# Altium schematic sheet pca10090_sheet8_power_supply.SchDoc: Power Supply
size A3; Organization: Nordic Semiconductor; DocumentNumber: 8; SheetNumber: 8; SheetTotal: 8; CompanyName: Nordic Semiconductor; DocumentSize: A3
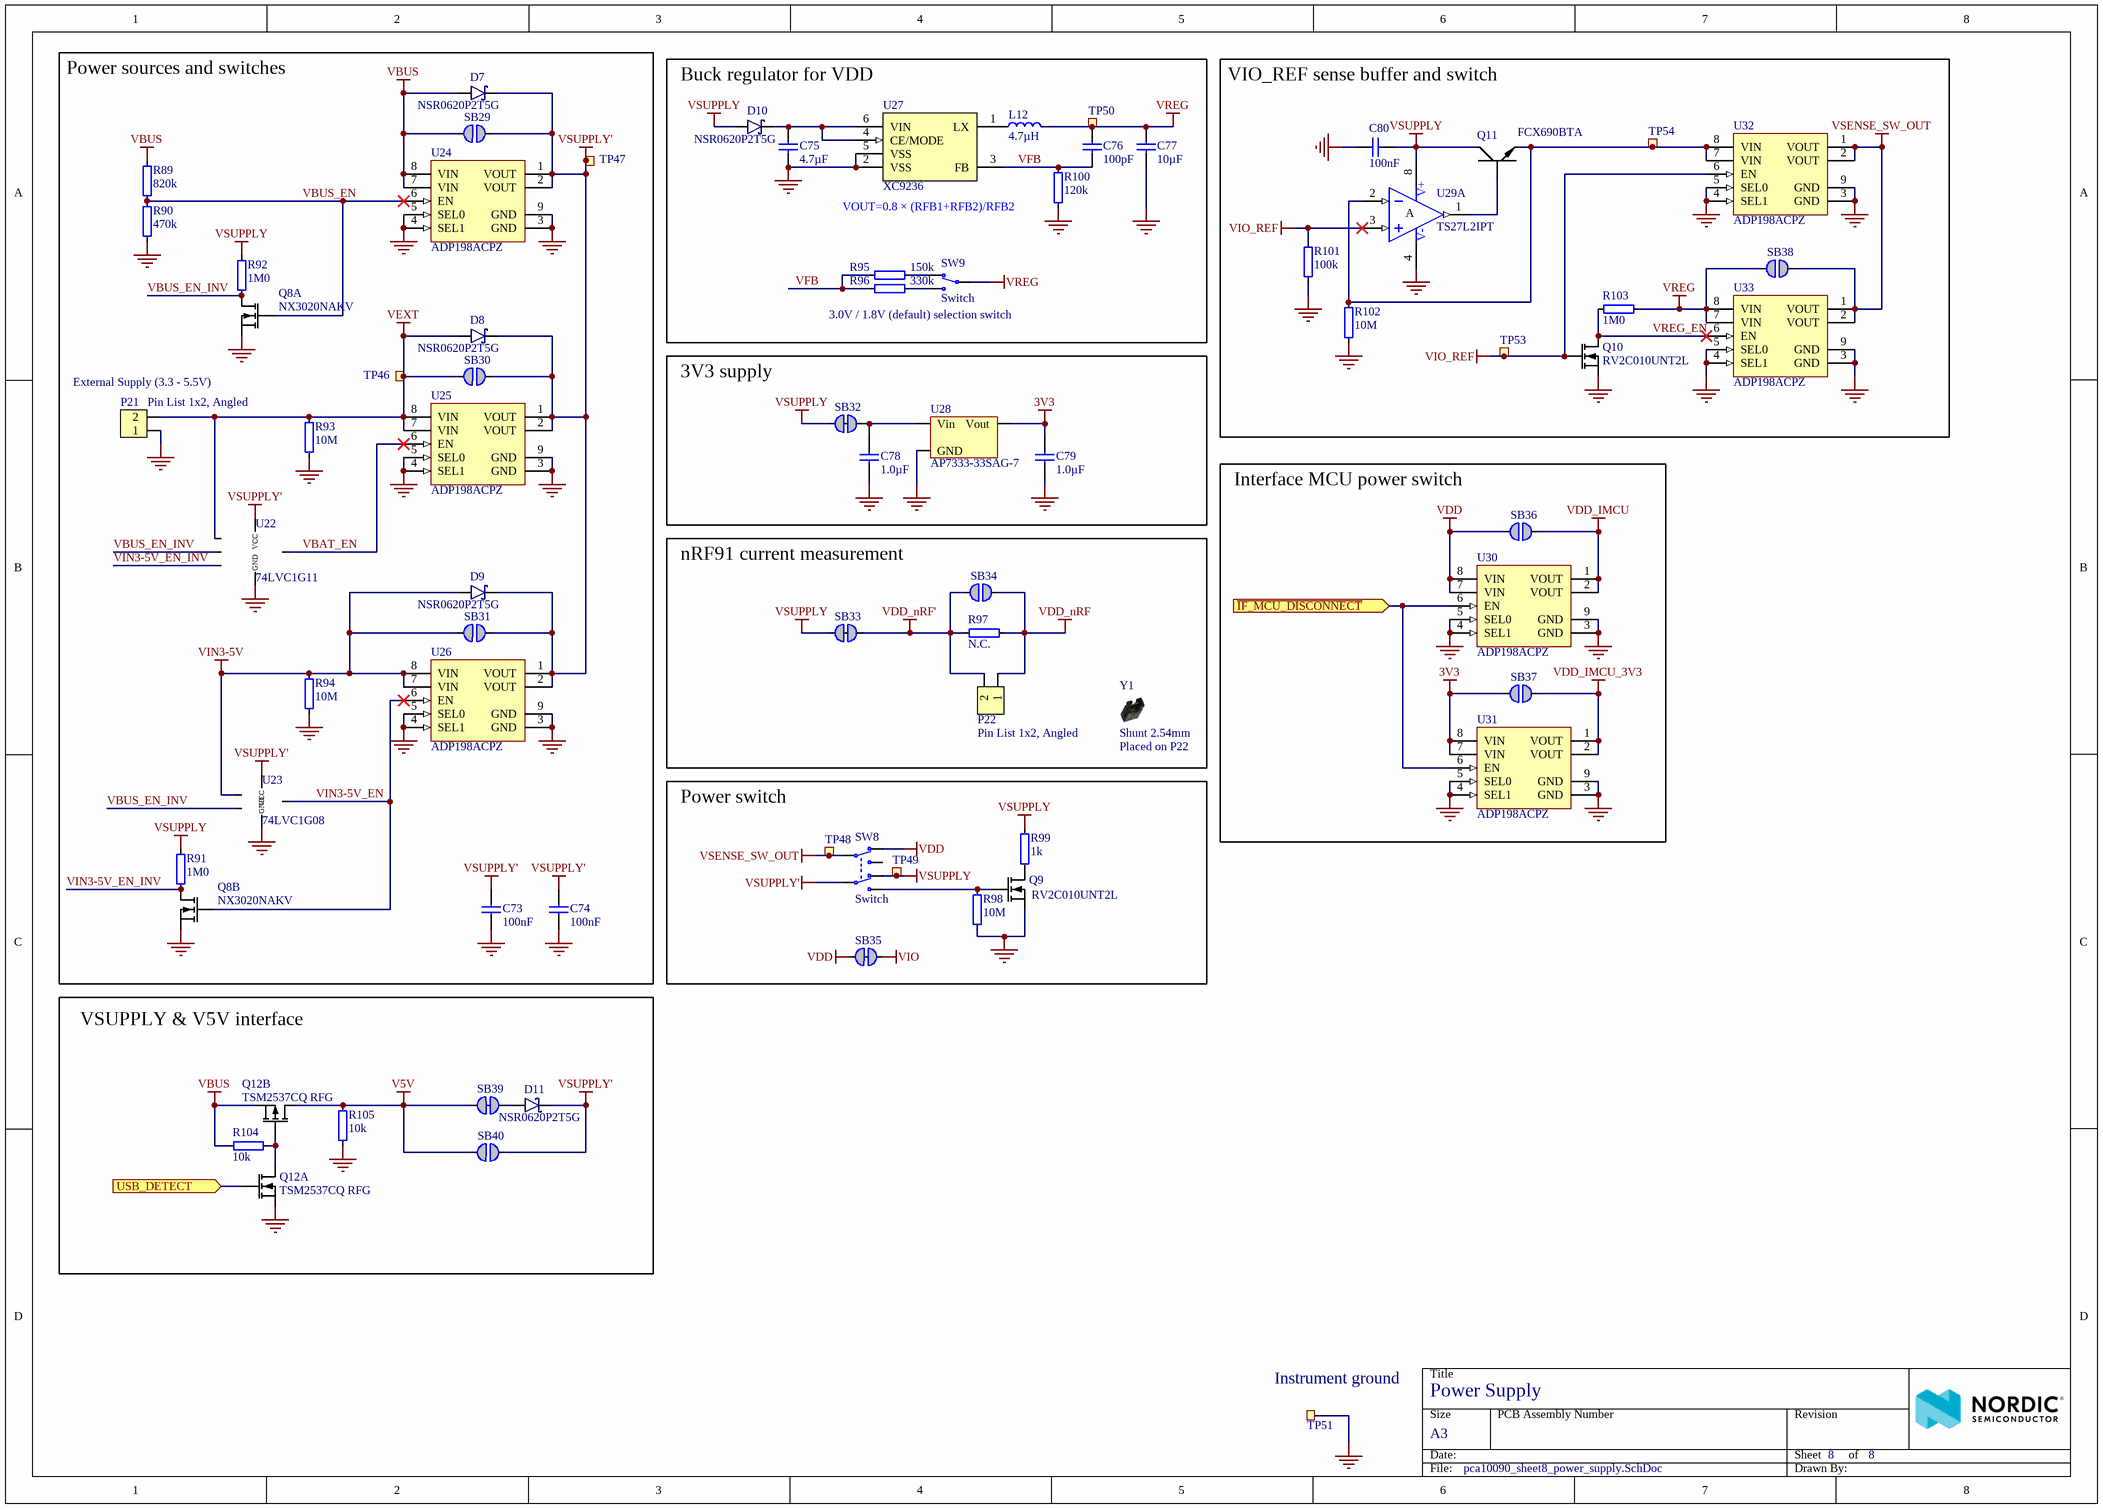
[diagram p0: pca10090_sheet8_power_supply.SchDoc]

## Parts
C73  100nF  [CAPC0603X03L_C]
C74  100nF  [CAPC0603X03L_C]
C75  4.7µF  [CAPC1005X04L]
C76  100pF  [CAPC0603X03L_C]
C77  10µF  [CAPC1608X06L]
C78  1.0µF  [CAPC0603X03L_C]
C79  1.0µF  [CAPC0603X03L_C]
C80  100nF  [CAPC0603X03L_C]
D7  NSR0620P2T5G  [SODFL100X40-2N]
D8  NSR0620P2T5G  [SODFL100X40-2N]
D9  NSR0620P2T5G  [SODFL100X40-2N]
D10  NSR0620P2T5G  [SODFL100X40-2N]
D11  NSR0620P2T5G  [SODFL100X40-2N]
L12  4.7µH  [TY-NR3015]
P21  Pin List 1x2, Angled  [LIST_ANG_1x2-SMD-2.54MM]
P22  Pin List 1x2, Angled  [LIST_ANG_1x2-SMD-2.54MM]
Q8  NX3020NAKV  [NX3020NAKV]  (parts A,B of 2)
Q9  RV2C010UNT2L  [DFN65P100X40-3L]
Q10  RV2C010UNT2L  [DFN65P100X40-3L]
Q11  FCX690BTA  [SOT89-150P409X160-3N]
Q12  TSM2537CQ RFG  [DFN65P200X200X80_HS-6N]  (parts A,B of 2)
R89  820k  [RESC0603X03L_C]
R90  470k  [RESC0603X03L_C]
R91  1M0  [RESC0603X03L_C]
R92  1M0  [RESC0603X03L_C]
R93  10M  [RESC0603X03L_C]
R94  10M  [RESC0603X03L_C]
R95  150k  [RESC0603X03L_C]
R96  330k  [RESC0603X03L_C]
R97  N.C.  [RESC1005X04L_NC]
R98  10M  [RESC0603X03L_C]
R99  1k  [RESC0603X03L_C]
R100  120k  [RESC0603X03L_C]
R101  100k  [RESC0603X03L_C]
R102  10M  [RESC0603X03L_C]
R103  1M0  [RESC0603X03L_C]
R104  10k  [RESC0603X03L_C]
R105  10k  [RESC0603X03L_C]
SB29  Solderbridge  [Solderbridge]  (value not drawn)  (no BOM)
SB30  Solderbridge  [Solderbridge]  (value not drawn)  (no BOM)
SB31  Solderbridge  [Solderbridge]  (value not drawn)  (no BOM)
SB32  Solderbridge  [Solderbridge_Shorted]  (value not drawn)  (net tie, no BOM)
SB33  Solderbridge  [Solderbridge_Shorted_Power]  (value not drawn)  (net tie, no BOM)
SB34  Solderbridge  [Solderbridge]  (value not drawn)  (no BOM)
SB35  Solderbridge  [Solderbridge_Shorted]  (value not drawn)  (net tie, no BOM)
SB36  Solderbridge  [Solderbridge]  (value not drawn)  (no BOM)
SB37  Solderbridge  [Solderbridge]  (value not drawn)  (no BOM)
SB38  Solderbridge  [Solderbridge]  (value not drawn)  (no BOM)
SB39  Solderbridge  [Solderbridge_Shorted]  (value not drawn)  (net tie, no BOM)
SB40  Solderbridge  [Solderbridge]  (value not drawn)  (no BOM)
SW8  Switch  [JS102011JAQN]
SW9  Switch  [CJS-120xA]
TP46  Ø1.5mm,SMD  [TP_SMD_D1.5mm]  (value not drawn)  (no BOM)
TP47  Ø1.5mm,SMD  [TP_SMD_D1.5mm]  (value not drawn)  (no BOM)
TP48  Ø1.5mm,SMD  [TP_SMD_D1.5mm]  (value not drawn)  (no BOM)
TP49  Ø1.5mm,SMD  [TP_SMD_D1.5mm]  (value not drawn)  (no BOM)
TP50  Ø1.5mm,SMD  [TP_SMD_D1.5mm]  (value not drawn)  (no BOM)
TP51  TP  [TESTPAD-TH]  (value not drawn)  (no BOM)
TP53  Ø1.5mm,SMD  [TP_SMD_D1.5mm]  (value not drawn)  (no BOM)
TP54  Ø1.5mm,SMD  [TP_SMD_D1.5mm]  (value not drawn)  (no BOM)
U22  74LVC1G11  [SOT65P210X100-6N]
U23  74LVC1G08  [SOT65P210X100-5N]
U24  ADP198ACPZ  [UFDFN50P200X200X60_HS-9N]
U25  ADP198ACPZ  [UFDFN50P200X200X60_HS-9N]
U26  ADP198ACPZ  [UFDFN50P200X200X60_HS-9N]
U27  XC9236  [USP-6C]
U28  AP7333-33SAG-7  [SOT-23A]
U29  TS27L2IPT  [TSOP65P640X120-8N]  (part A of 2)
U30  ADP198ACPZ  [UFDFN50P200X200X60_HS-9N]
U31  ADP198ACPZ  [UFDFN50P200X200X60_HS-9N]
U32  ADP198ACPZ  [UFDFN50P200X200X60_HS-9N]
U33  ADP198ACPZ  [UFDFN50P200X200X60_HS-9N]
Y1  Shunt 2.54mm  Assembly: Placed on P22  [Shunt_2.54mm_Horizontal]

## Blocks framed on the sheet
Power sources and switches: C73 C74 D7-D9 P21 Q8 R89-R94 SB29-SB31 TP46 TP47 U22-U26
Buck regulator for VDD: C75-C77 D10 L12 R95 R96 R100 SW9 TP50 U27
VIO_REF sense buffer and switch: C80 Q10 Q11 R101-R103 SB38 TP53 TP54 U29 U32 U33
3V3 supply: C78 C79 SB32 U28
Interface MCU power switch: SB36 SB37 U30 U31
nRF91 current measurement: P22 R97 SB33 SB34 Y1
Power switch: Q9 R98 R99 SB35 SW8 TP48 TP49
VSUPPLY & V5V interface: D11 Q12 R104 R105 SB39 SB40

## Ports
USB_DETECT (in), ~{IF_MCU_DISCONNECT} (in)

## Nets
3V3: C79.1 SB37.1 U28.2(Vout) U31.7(VIN) U31.8(VIN)
GND: C73.2 C74.1 C75.1 C77.1 C78.2 C79.2 C80.1 P21.1 Q8.1(S1) Q8.4(S2) Q9.2(S) Q10.2(S) Q12.1(S1) R90.1 R93.1 R94.1 R98.1 R100.1 R101.2 R102.1 R105.1 TP51.1 U22.2(GND) U23.3(GND) U24.3(GND) U24.4(SEL1) U24.5(SEL0) U24.9(GND) U25.3(GND) U25.4(SEL1) U25.5(SEL0) U25.9(GND) U26.3(GND) U26.4(SEL1) U26.5(SEL0) U26.9(GND) U27.2(VSS) U27.5(VSS) U27.7(VSS) U28.3(GND) U29.4(V-) U30.3(GND) U30.4(SEL1) U30.5(SEL0) U30.9(GND) U31.3(GND) U31.4(SEL1) U31.5(SEL0) U31.9(GND) U32.3(GND) U32.4(SEL1) U32.5(SEL0) U32.9(GND) U33.3(GND) U33.4(SEL1) U33.5(SEL0) U33.9(GND)
V5V: Q12.3(D2) R105.2 SB39.1 SB40.2
VBUS: D7.2(A) Q12.4(S2) R89.2 R104.1 SB29.2 U24.7(VIN) U24.8(VIN)
VDD: SB35.2 SB36.2 SW8.3(N.C-1) U30.7(VIN) U30.8(VIN)
VDD_IMCU: SB36.1 U30.1(VOUT) U30.2(VOUT)
VDD_IMCU_3V3: SB37.2 U31.1(VOUT) U31.2(VOUT)
VDD_nRF: P22.1 R97.1 SB34.1
VDD_nRF': P22.2 R97.2 SB33.2 SB34.2
VEXT: D8.2(A) P21.2 R93.2 SB30.2 TP46.1 U22.1(A) U25.7(VIN) U25.8(VIN)
VIN3-5V: D9.2(A) R94.2 SB31.2 U23.1(A) U26.7(VIN) U26.8(VIN)
VIO: SB35.1
VIO_REF: Q10.1(G) R101.1 TP53.1 U29.3(IN1+) U32.6(EN)
VREG: C76.2 C77.2 L12.2 R103.2 SB38.2 SW9.2(COM) TP50.1 U33.7(VIN) U33.8(VIN)
VSENSE_SW_OUT: SB38.1 SW8.2(COM-1) TP48.1 U32.1(VOUT) U32.2(VOUT) U33.1(VOUT) U33.2(VOUT)
VSUPPLY: C80.2 D10.2(A) Q11.2(C) R91.2 R92.2 R99.2 SB32.2 SB33.1 SW8.6(N.C-2) TP49.1 U29.8(V+)
VSUPPLY': C73.1 C74.2 D7.1(C) D8.1(C) D9.1(C) D11.1(C) SB29.1 SB30.1 SB31.1 SB40.1 SW8.5(COM-2) TP47.1 U22.5(VCC) U23.5(VCC) U24.1(VOUT) U24.2(VOUT) U25.1(VOUT) U25.2(VOUT) U26.1(VOUT) U26.2(VOUT)
~{IF_MCU_DISCONNECT}: U30.6(EN) U31.6(EN) ; port ~{IF_MCU_DISCONNECT}
USB_DETECT: Q12.2(G1) ; port USB_DETECT
VBAT_EN: U22.4(Y) U25.6(EN)
VBUS_EN: Q8.2(G1) R89.1 R90.2 U24.6(EN)
VBUS_EN_INV: Q8.6(D1) R92.1 U22.3(B) U23.2(B)
VFB: C76.1 R95.1 R96.1 R100.2 U27.3(FB)
VIN3-5V_EN: Q8.5(G2) U23.4(Y) U26.6(EN)
VIN3-5V_EN_INV: Q8.3(D2) R91.1 U22.6(C)
VREG_EN: Q10.3(D) R103.1 U33.6(EN)
NetC75_2: C75.2 D10.1(C) U27.4(CE/MODE) U27.6(VIN)
NetC78_1: C78.1 SB32.1 U28.1(Vin)
NetD11_2: D11.2(A) SB39.2
NetL12_1: L12.1 U27.1(LX)
NetQ9_1: Q9.1(G) R98.2 SW8.4(N.O-2)
NetQ9_3: Q9.3(D) R99.1
NetQ11_1: Q11.1(B) U29.1(OUT1)
NetQ11_3: Q11.3(E) R102.2 TP54.1 U29.2(IN1-) U32.7(VIN) U32.8(VIN)
NetQ12_5: Q12.5(G2) Q12.6(D1) R104.2
NetR95_2: R95.2 SW9.1(N.C)
NetR96_2: R96.2 SW9.3(N.O)

Not connected (* = marked no-connect by the designer): SW8 1(N.O-1)

## Notes on the sheet
- VOUT=0.8 × (RFB1+RFB2)/RFB2
- 3.0V / 1.8V (default) selection switch
- (near P21) External Supply (3.3 - 5.5V)
- (near TP51) Instrument ground
- Title
- Size
- Date:
- A3
- PCB Assembly Number
- Sheet         of
- Revision
- File:
- Drawn By:
- (in symbol TS27L2IPT, part A) A

## Library data of the parts
C73 C74 C80 = C0201-100n: Capacitor, X5R, ±10%; Manufacturer: N.A.; Part number IPS: 00000001248, 00000002505; Note: 16V; Pad Count: 2; Part Number: C0201-100n; Manufacturer Part Number: N.A.; ComponentLink1URL: N.A.; ComponentLink1Description: Datasheet; ComponentLink2URL: N.A.; ComponentLink2Description: Supplier link; HelpURL: N.A.; Footprint Doc: 0201; LatestRevisionDate: 2017-11-09; Published: 2014-11-13; Value: 100nF; Artikkelnr Noca: N.A.; Supplier 1: N.A.; Supplier Part Number 1: N.A.; Supplier 2: N.A.; Supplier Part Number 2: N.A.; PartId: 100200078; Component Class: Capacitors; Author: rsk; Part number Norautron: N.A.
C75 = C0402-4µ7: Capacitor, X5R, ±20%; Manufacturer: N.A.; Part number IPS: 00000001251, 00000007165; Note: 10V; Artikkelnr Noca: 20039482; Pad Count: 2; Part Number: C0402-4µ7; Manufacturer Part Number: N.A.; ComponentLink1URL: N.A.; ComponentLink1Description: Datasheet; ComponentLink2URL: N.A.; ComponentLink2Description: Supplier link; HelpURL: N.A.; Footprint Doc: 0402; LatestRevisionDate: 2017-11-09; Published: 2009-05-08; Value: 4.7µF; Supplier 1: Digi-Key; Supplier Part Number 1: 490-13252-1-ND; Supplier 2: N.A.; Supplier Part Number 2: N.A.; PartId: 100200193; Component Class: Capacitors; Author: rsk; Part number Norautron: N.A.
C76 = C0201-100p: Capacitor, NP0, ±2%, 25V; Manufacturer: Murata; Manufacturer Part Number: GRM0335C1E101GA01; Part number IPS: 00000007853; Artikkelnr Noca: N.A.; Pad Count: 2; Part Number: C0201-100p; ComponentLink1URL: N.A.; ComponentLink1Description: Datasheet; ComponentLink2URL: N.A.; ComponentLink2Description: Supplier link; HelpURL: N.A.; Footprint Doc: 0201; LatestRevisionDate: 2019-04-16; Published: 2019-04-16; Value: 100pF; Note: 25V; Supplier 1: N.A.; Supplier Part Number 1: N.A.; Supplier 2: N.A.; Supplier Part Number 2: N.A.; PartId: 100200044; Component Class: Capacitors; Author: rsk; Part number Norautron: N.A.
C77 = C0603-10µ-25V-X5R-CL10A106MA8NRNC: Capacitor, X5R, ±20%, 25V; Manufacturer: Samsung Electro-Mechanics America; Part number IPS: 00000009948; Part number Norautron: N.A.; Artikkelnr Noca: 20039436; Pad Count: 2; Part Number: C0603-10µ-25V-X5R-CL10A106MA8NRNC; Manufacturer Part Number: CL10A106MA8NRNC; Footprint Doc: 0603; LatestRevisionDate: 2021-07-21; Published: 2015-04-10; Value: 10µF; Note: 25V; ComponentLink1URL: N.A.; ComponentLink1Description: Datasheet; ComponentLink2URL: N.A.; ComponentLink2Description: Supplier link; HelpURL: http://www.samsungsem.com/kr/front/downloadcms.do?path=/kr/support/product-search/mlcc/__icsFiles/afieldfile/2014/11/05&fileName=S_CL10A106MA8NRNC.pdf; Supplier 1: Digi-Key; Supplier Part Number 1: 1276-1869-1-ND; Supplier 2: N.A.; Supplier Part Number 2: N.A.; PartId: 100200354; Component Class: Capacitors; Author: rsk
C78 C79 = C0201-1µ0: Capacitor, X5R, ±10%; Manufacturer: N.A.; Part number IPS: 00000001723; Note: 10V; Pad Count: 2; Part Number: C0201-1µ0; Manufacturer Part Number: N.A.; ComponentLink1URL: N.A.; ComponentLink1Description: Datasheet; ComponentLink2URL: N.A.; ComponentLink2Description: Supplier link; HelpURL: N.A.; Footprint Doc: 0201; LatestRevisionDate: 2016-08-22; Published: 2009-05-08; Value: 1.0µF; Supplier 1: Digi-Key; Supplier Part Number 1: 1276-6795-1-ND; Supplier 2: N.A.; Supplier Part Number 2: N.A.; Artikkelnr Noca: N.A.; PartId: 100200084; Component Class: Capacitors; Author: rsk; Part number Norautron: N.A.
D7-D11 = NSR0620P2T5G: 20V schottky barrier diode, Vf 350 mV @ 100 mA, Ir 2.0 µA @ 10 V, If 500 mA; Manufacturer: ON Semiconductor; Part number IPS: 00000009952; Note: N.A.; Artikkelnr Noca: 10029169; Pad Count: 2; Part Number: NSR0620P2T5G; Manufacturer Part Number: NSR0620P2T5G; LatestRevisionDate: 2016-07-07; Published: 2016-07-07; Value: NSR0620P2T5G; Footprint Doc: SOD-923; ComponentLink1URL: N.A.; ComponentLink1Description: Datasheet; ComponentLink2URL: N.A.; ComponentLink2Description: Supplier link; HelpURL: http://www.onsemi.com/pub_link/Collateral/NSR0620P2-D.PDF; Supplier 1: Digi-Key; Supplier Part Number 1: NSR0620P2T5GOSCT-ND; Supplier 2: N.A.; Supplier Part Number 2: N.A.; PartId: 101300131; Component Class: Semiconductors; Author: rsk; Part number Norautron: N.A.
L12 = NR3015-4µ7-1.04A-144mOhm: Ferrite Inductor, Shielded, 1,04A, 144mOhm; Manufacturer: Taiyo Yuden; Manufacturer Part Number: NR3015T4R7M; Part number IPS: 00000009960; Note: N.A.; Artikkelnr Noca: 33029551; Pad Count: 2; Part Number: NR3015-4µ7-1.04A-144mOhm; Footprint Doc: 1212; LatestRevisionDate: 2014-01-22; Published: 2014-01-22; Value: 4.7µH; ComponentLink1URL: N.A.; ComponentLink1Description: Datasheet; ComponentLink2URL: N.A.; ComponentLink2Description: Supplier link; HelpURL: http://www.yuden.co.jp/ut/product/category/inductor/NR3015T4R7M.pdf; Supplier 1: Digi-Key; Supplier Part Number 1: 587-1649-1-ND; Supplier 2: Mouser; Supplier Part Number 2: 963-NR3015T4R7M; PartId: 100300145; Component Class: Inductors; Author: rsk; Part number Norautron: N.A.
P21 P22 = Pin List Ang 1x2 SMD, 2.54mm: Pin List 1x2, 2.54mm (100mil), Right Angled, SMD; Manufacturer: W-CON; Manufacturer Part Number: 1125B-1102S0Z135R2; Part number IPS: 00000009972; Note: N.A.; Artikkelnr Noca: 55010023; Pad Count: 2; Part Number: Pin List Ang 1x2 SMD, 2.54mm; Footprint Doc: LIST_ANG_1x2-SMD-2.54MM; LatestRevisionDate: 2016-05-26; Published: 2016-01-22; Value: Pin List 1x2, Angled; ComponentLink1URL: N.A.; ComponentLink1Description: Datasheet; ComponentLink2URL: N.A.; ComponentLink2Description: Supplier link; HelpURL: \\hizz\pro\app9717\Datasheet\connectors\W-CON\1125B-11XXXXZXXXXX.pdf; Supplier 1: Cabcon; Supplier Part Number 1: 1125B-1102S0Z135R2; Supplier 2: Samtec; Supplier Part Number 2: TSM-102-01-L-SH-A; PartId: 100500354; Component Class: Connectors; Author: rsk; Part number Norautron: N.A.
Q8 = NX3020NAKV: MOSFET 2N-CH 30V 0.2A SOT666; Manufacturer: Nexperia; Manufacturer Part Number: NX3020NAKV,115; Part number IPS: 00000001724; Note: N.A.; Pad Count: 6; Part Number: NX3020NAKV; LatestRevisionDate: 2018-12-13; Published: 2018-12-13; Value: NX3020NAKV; Artikkelnr Noca: N.A.; Footprint Doc: SOT666; ComponentLink1URL: https://assets.nexperia.com/documents/data-sheet/NX3020NAKV.pdf; ComponentLink1Description: Datasheet; ComponentLink2URL: N.A.; ComponentLink2Description: Supplier link; HelpURL: N.A.; Supplier 1: Digi-Key; Supplier Part Number 1: 1727-1287-2-ND; Supplier 2: Mouser; Supplier Part Number 2: 771-NX3020NAKV115; PartId: 101300163; Component Class: Semiconductors; Author: rsk; Part number Norautron: N.A.
Q9 Q10 = RV2C010UNT2L: N-Channel MOSFET, 20V, 1A, 470mOhm, 400mW; Manufacturer: Rohm Semiconductor; Part number IPS: 00000009976; Note: N.A.; Artikkelnr Noca: 35010020; Pad Count: 3; Part Number: RV2C010UNT2L; Manufacturer Part Number: RV2C010UNT2L; Footprint Doc: DFN-3; LatestRevisionDate: 2016-08-09; Published: 2016-08-09; Value: RV2C010UNT2L; ComponentLink1URL: N.A.; ComponentLink1Description: Datasheet; ComponentLink2URL: N.A.; ComponentLink2Description: Supplier link; HelpURL: http://rohmfs.rohm.com/en/products/databook/datasheet/discrete/transistor/mosfet/rv2c010unt2l-e.pdf; Supplier 1: Digi-Key; Supplier Part Number 1: RV2C010UNT2LCT-ND; Supplier 2: Mouser; Supplier Part Number 2: 755-RV2C010UNT2L; PartId: 101300132; Component Class: Semiconductors; Author: rsk; Part number Norautron: N.A.
Q11 = FCX690BTA: 45V NPN high gain power transistor; Manufacturer: Diodes Incorporated; Part number IPS: 00000009974; Note: N.A.; Artikkelnr Noca: 35010019; Pad Count: 3; Part Number: FCX690BTA; Manufacturer Part Number: FCX690BTA; Footprint Doc: SOT-89; LatestRevisionDate: 2016-07-07; Published: 2016-07-07; Value: FCX690BTA; ComponentLink1URL: N.A.; ComponentLink1Description: Datasheet; ComponentLink2URL: N.A.; ComponentLink2Description: Supplier link; HelpURL: http://www.diodes.com/_files/datasheets/FCX690B.pdf; Supplier 1: Digi-Key; Supplier Part Number 1: FCX690BCT-ND; Supplier 2: N.A.; Supplier Part Number 2: N.A.; PartId: 101300130; Component Class: Semiconductors; Author: rsk; Part number Norautron: N.A.
Q12 = TSM2537CQ RFG: Dual N & P Ch MOFET, 11.6A/9A, 90mOhm max, 6.25W; Manufacturer: Taiwan Semiconductor; Part number IPS: 00000001702; Note: N.A.; Pad Count: 6; Part Number: TSM2537CQ RFG; Manufacturer Part Number: TSM2537CQ RFG; LatestRevisionDate: 2018-10-29; Published: 2018-10-29; Value: TSM2537CQ RFG; Artikkelnr Noca: N.A.; Footprint Doc: VDFN-6; ComponentLink1URL: https://www.taiwansemi.com/products/datasheet/TSM2537CQ_A1610.pdf; ComponentLink1Description: Datasheet; ComponentLink2URL: N.A.; ComponentLink2Description: Supplier link; HelpURL: https://www.taiwansemi.com/products/datasheet/TSM2537CQ_A1610.pdf; Supplier 1: Digi-Key; Supplier Part Number 1: TSM2537CQRFGCT-ND; Supplier 2: N.A.; Supplier Part Number 2: N.A.; PartId: 101300160; Component Class: Semiconductors; Author: rsk; Part number Norautron: N.A.
R89 = R0201-820k: Resistor, ±1%, 0.05W; Manufacturer: N.A.; Part number IPS: 00000001427; Note: Chip Res 1%; Pad Count: 2; Part Number: R0201-820k; Manufacturer Part Number: N.A.; ComponentLink1URL: N.A.; ComponentLink1Description: Datasheet; ComponentLink2URL: N.A.; ComponentLink2Description: Supplier link; HelpURL: N.A.; Footprint Doc: 0201; LatestRevisionDate: 2014-11-13; Published: 2014-11-13; Value: 820k; Artikkelnr Noca: N.A.; Supplier 1: N.A.; Supplier Part Number 1: N.A.; Supplier 2: N.A.; Supplier Part Number 2: N.A.; PartId: 100100092; Component Class: Resistors; Author: rsk; Part number Norautron: N.A.
R90 = R0201-470k: Resistor, ±1%, 0.05W; Manufacturer: N.A.; Part number IPS: 00000001428; Note: Chip Res 1%; Pad Count: 2; Part Number: R0201-470k; Manufacturer Part Number: N.A.; ComponentLink1URL: N.A.; ComponentLink1Description: Datasheet; ComponentLink2URL: N.A.; ComponentLink2Description: Supplier link; HelpURL: N.A.; Footprint Doc: 0201; LatestRevisionDate: 2014-11-13; Published: 2014-11-13; Value: 470k; Artikkelnr Noca: N.A.; Supplier 1: N.A.; Supplier Part Number 1: N.A.; Supplier 2: N.A.; Supplier Part Number 2: N.A.; PartId: 100100089; Component Class: Resistors; Author: rsk; Part number Norautron: N.A.
R91 R92 R103 = R0201-1M0: Resistor, ±1%, 0.05W; Manufacturer: N.A.; Part number IPS: 00000001418; Note: Chip Res 1%; Pad Count: 2; Part Number: R0201-1M0; Manufacturer Part Number: N.A.; ComponentLink1URL: N.A.; ComponentLink1Description: Datasheet; ComponentLink2URL: N.A.; ComponentLink2Description: Supplier link; HelpURL: N.A.; Footprint Doc: 0201; LatestRevisionDate: 2014-11-13; Published: 2014-11-13; Value: 1M0; Artikkelnr Noca: N.A.; Supplier 1: N.A.; Supplier Part Number 1: N.A.; Supplier 2: N.A.; Supplier Part Number 2: N.A.; PartId: 100100093; Component Class: Resistors; Author: rsk; Part number Norautron: N.A.
R93 R94 R98 R102 = R0201-10M: Resistor, ±1%, 0.05W; Manufacturer: N.A.; Part number IPS: 00000001426; Note: Chip Res 1%; Pad Count: 2; Part Number: R0201-10M; Manufacturer Part Number: N.A.; ComponentLink1URL: N.A.; ComponentLink1Description: Datasheet; ComponentLink2URL: N.A.; ComponentLink2Description: Supplier link; HelpURL: N.A.; Footprint Doc: 0201; LatestRevisionDate: 2014-11-13; Published: 2014-11-13; Value: 10M; Artikkelnr Noca: N.A.; Supplier 1: N.A.; Supplier Part Number 1: N.A.; Supplier 2: N.A.; Supplier Part Number 2: N.A.; PartId: 100100105; Component Class: Resistors; Author: rsk; Part number Norautron: N.A.
R95 = R0201-150k: Resistor, ±1%, 0.05W; Manufacturer: N.A.; Part number IPS: 00000001422; Note: Chip Res 1%; Pad Count: 2; Part Number: R0201-150k; Manufacturer Part Number: N.A.; ComponentLink1URL: N.A.; ComponentLink1Description: Datasheet; ComponentLink2URL: N.A.; ComponentLink2Description: Supplier link; HelpURL: N.A.; Footprint Doc: 0201; LatestRevisionDate: 2014-11-13; Published: 2014-11-13; Value: 150k; Artikkelnr Noca: N.A.; Supplier 1: N.A.; Supplier Part Number 1: N.A.; Supplier 2: N.A.; Supplier Part Number 2: N.A.; PartId: 100100082; Component Class: Resistors; Author: rsk; Part number Norautron: N.A.
R96 = R0201-330k: Resistor, ±1%, 0.05W; Manufacturer: N.A.; Part number IPS: 00000001424; Note: Chip Res 1%; Pad Count: 2; Part Number: R0201-330k; Manufacturer Part Number: N.A.; ComponentLink1URL: N.A.; ComponentLink1Description: Datasheet; ComponentLink2URL: N.A.; ComponentLink2Description: Supplier link; HelpURL: N.A.; Footprint Doc: 0201; LatestRevisionDate: 2014-11-13; Published: 2014-11-13; Value: 330k; Artikkelnr Noca: N.A.; Supplier 1: N.A.; Supplier Part Number 1: N.A.; Supplier 2: N.A.; Supplier Part Number 2: N.A.; PartId: 100100087; Component Class: Resistors; Author: rsk; Part number Norautron: N.A.
R97 = R0402-N.C.: Not mounted; Manufacturer: N.A.; Note: Chip Res; Assembly: Not mounted; Pad Count: 2; Part Number: R0402-N.C.; Manufacturer Part Number: N.A.; LatestRevisionDate: 2009-05-08; Published: 2009-05-08; Value: N.C.; Artikkelnr Noca: N.A.; Footprint Doc: 0402; Part number IPS: N.A.; ComponentLink1URL: N.A.; ComponentLink1Description: Datasheet; ComponentLink2URL: N.A.; ComponentLink2Description: Supplier link; HelpURL: N.A.; Supplier 1: N.A.; Supplier Part Number 1: N.A.; Supplier 2: N.A.; Supplier Part Number 2: N.A.; PartId: 100100281; Component Class: Resistors; Author: rsk; Part number Norautron: N.A.
R99 = R0201-1k0: Resistor, ±1%, 0.05W; Manufacturer: N.A.; Part number IPS: 00000005786; Note: Chip Res 1%; Pad Count: 2; Part Number: R0201-1k0; Manufacturer Part Number: N.A.; ComponentLink1URL: N.A.; ComponentLink1Description: Datasheet; ComponentLink2URL: N.A.; ComponentLink2Description: Supplier link; HelpURL: N.A.; Footprint Doc: 0201; LatestRevisionDate: 2014-11-13; Published: 2014-11-13; Value: 1k; Artikkelnr Noca: N.A.; Supplier 1: N.A.; Supplier Part Number 1: N.A.; Supplier 2: N.A.; Supplier Part Number 2: N.A.; PartId: 100100043; Component Class: Resistors; Author: rsk; Part number Norautron: N.A.
R100 = R0201-120k: Resistor, ±1%, 0.05W; Manufacturer: N.A.; Part number IPS: 00000001425; Note: Chip Res 1%; Pad Count: 2; Part Number: R0201-120k; Manufacturer Part Number: N.A.; ComponentLink1URL: N.A.; ComponentLink1Description: Datasheet; ComponentLink2URL: N.A.; ComponentLink2Description: Supplier link; HelpURL: N.A.; Footprint Doc: 0201; LatestRevisionDate: 2014-11-13; Published: 2014-11-13; Value: 120k; Artikkelnr Noca: N.A.; Supplier 1: N.A.; Supplier Part Number 1: N.A.; Supplier 2: N.A.; Supplier Part Number 2: N.A.; PartId: 100100081; Component Class: Resistors; Author: rsk; Part number Norautron: N.A.
R101 = R0201-100k: Resistor, ±1%, 0.05W; Manufacturer: N.A.; Part number IPS: 00000001419; Note: Chip Res 1%; Pad Count: 2; Part Number: R0201-100k; Manufacturer Part Number: N.A.; ComponentLink1URL: N.A.; ComponentLink1Description: Datasheet; ComponentLink2URL: N.A.; ComponentLink2Description: Supplier link; HelpURL: N.A.; Footprint Doc: 0201; LatestRevisionDate: 2014-11-13; Published: 2014-11-13; Value: 100k; Supplier 1: N.A.; Supplier Part Number 1: N.A.; Supplier 2: N.A.; Supplier Part Number 2: N.A.; Artikkelnr Noca: N.A.; PartId: 100100080; Component Class: Resistors; Author: rsk; Part number Norautron: N.A.
R104 R105 = R0201-10k: Resistor, ±1%, 0.05W; Manufacturer: N.A.; Part number IPS: 00000001255; Note: Chip Res 1%; Pad Count: 2; Part Number: R0201-10k; Manufacturer Part Number: N.A.; ComponentLink1URL: N.A.; ComponentLink1Description: Datasheet; ComponentLink2URL: N.A.; ComponentLink2Description: Supplier link; HelpURL: N.A.; Footprint Doc: 0201; LatestRevisionDate: 2014-11-13; Published: 2014-11-13; Value: 10k; Artikkelnr Noca: N.A.; Supplier 1: N.A.; Supplier Part Number 1: N.A.; Supplier 2: N.A.; Supplier Part Number 2: N.A.; PartId: 100100065; Component Class: Resistors; Author: rsk; Part number Norautron: N.A.
SB29-SB31 SB34 SB36-SB38 SB40 = Solderbridge: Manufacturer: N.A.; Pad Count: 2; Part Number: Solderbridge; Manufacturer Part Number: N.A.; LatestRevisionDate: 2009-12-14; Published: 2009-12-14; Value: Solderbridge; Note: N.A.; Artikkelnr Noca: N.A.; Footprint Doc: Solderbridge; Part number IPS: N.A.; ComponentLink1URL: N.A.; ComponentLink1Description: Datasheet; ComponentLink2URL: N.A.; ComponentLink2Description: Supplier link; HelpURL: N.A.; Supplier 1: N.A.; Supplier Part Number 1: N.A.; Supplier 2: N.A.; Supplier Part Number 2: N.A.; PartId: 100500458; Component Class: Connectors; Author: rsk; Part number Norautron: N.A.
SB32 SB35 SB39 = Solderbridge Shorted: Shorted Solderbridge; Manufacturer: N.A.; Pad Count: 2; Part Number: Solderbridge Shorted; Manufacturer Part Number: N.A.; ComponentLink1URL: N.A.; ComponentLink1Description: Datasheet; ComponentLink2URL: N.A.; ComponentLink2Description: Supplier link; HelpURL: N.A.; Footprint Doc: Solderbridge_Shorted; LatestRevisionDate: 2012-08-07; Published: 2012-08-07; Value: Solderbridge; Note: N.A.; Supplier 1: N.A.; Supplier Part Number 1: N.A.; Supplier 2: N.A.; Supplier Part Number 2: N.A.; Artikkelnr Noca: N.A.; Part number IPS: N.A.; PartId: 100500459; Component Class: Connectors; Author: rsk; Part number Norautron: N.A.
SB33 = Solderbridge Shorted Power: Shorted Solderbridge Power; Manufacturer: N.A.; Pad Count: 2; Part Number: Solderbridge Shorted Power; Manufacturer Part Number: N.A.; LatestRevisionDate: 2012-08-07; Published: 2012-08-07; Value: Solderbridge; Note: N.A.; Artikkelnr Noca: N.A.; Footprint Doc: Solderbridge_Shorted_Power; Part number IPS: N.A.; ComponentLink1URL: N.A.; ComponentLink1Description: Datasheet; ComponentLink2URL: N.A.; ComponentLink2Description: Supplier link; HelpURL: N.A.; Supplier 1: N.A.; Supplier Part Number 1: N.A.; Supplier 2: N.A.; Supplier Part Number 2: N.A.; PartId: 100500460; Component Class: Connectors; Author: rsk; Part number Norautron: N.A.
SW8 = Switch-Slide-RA-J-Lead-DPDT-8.5x3.5mm_C&K: SMD slide Switch (ON-ON); Manufacturer: C&K; Manufacturer Part Number: JS202011JAQN; Part number IPS: 00000007811; Note: N.A.; Pad Count: 6; Part Number: Switch-Slide-RA-J-Lead-DPDT-8.5x3.5mm_C&K; Footprint Doc: Switch-Slide-RA-J-Lead-DPDT-8.5x3.5mm; LatestRevisionDate: 2017-02-01; Published: 2016-09-15; Value: Switch; Artikkelnr Noca: N.A.; ComponentLink1URL: N.A.; ComponentLink1Description: Datasheet; ComponentLink2URL: N.A.; ComponentLink2Description: Supplier link; HelpURL: http://www.ck-components.com/media/1422/js.pdf; Supplier 1: Digi-Key; Supplier Part Number 1: CKN10722CT-ND; Supplier 2: Mouser; Supplier Part Number 2: 611-JS202011JAQN; PartId: 101500037; Component Class: Switches; Author: rsk; Part number Norautron: N.A.
SW9 = CJS-1200TA: SMD slide Switch (ON-ON); Manufacturer: Copal Electronics Inc; Part number IPS: 00000009982; Note: N.A.; Artikkelnr Noca: 50019068; Pad Count: 3; Part Number: CJS-1200TA; Manufacturer Part Number: CJS-1200TA; Footprint Doc: CJS-120xA; LatestRevisionDate: 2012-10-03; Published: 2012-10-03; Value: Switch; ComponentLink1URL: N.A.; ComponentLink1Description: Datasheet; ComponentLink2URL: N.A.; ComponentLink2Description: Supplier link; HelpURL: http://media.digikey.com/pdf/Data%20Sheets/COPAL%20Electronics%20PDFs/CJS.pdf; Supplier 1: Digi-Key; Supplier Part Number 1: 563-1021-2-ND; Supplier 2: N.A.; Supplier Part Number 2: N.A.; PartId: 101500005; Component Class: Switches; Author: rsk; Part number Norautron: N.A.
TP46-TP50 TP53 TP54 = TP_SMD_Ø1.5MM: 1.5mm circular SMD testpad; Manufacturer: Nordic Semiconductor; Manufacturer Part Number: N.A.; Pad Count: 1; Part Number: TP_SMD_Ø1.5MM; ComponentLink1URL: N.A.; ComponentLink1Description: Datasheet; ComponentLink2URL: N.A.; ComponentLink2Description: Supplier link; HelpURL: N.A.; Footprint Doc: TP_SMD_Ø1.5mm; LatestRevisionDate: 2021-03-05; Published: 2016-06-02; Value: Ø1.5mm,SMD; Note: N.A.; Artikkelnr Noca: N.A.; Part number IPS: N.A.; Supplier 1: N.A.; Supplier Part Number 1: N.A.; Supplier 2: N.A.; Supplier Part Number 2: N.A.; PartId: 100500477; Component Class: Connectors; Author: rsk; Part number Norautron: N.A.
TP51 = Testpoint TH: Testpoint, through hole; Manufacturer: N.A.; Pad Count: 1; Part Number: Testpoint TH; Manufacturer Part Number: N.A.; Footprint Doc: TESTPAD-TH; LatestRevisionDate: 2009-12-12; Published: 2009-12-12; Value: TP; Note: N.A.; Artikkelnr Noca: N.A.; Part number IPS: N.A.; ComponentLink1URL: N.A.; ComponentLink1Description: Datasheet; ComponentLink2URL: N.A.; ComponentLink2Description: Supplier link; HelpURL: N.A.; Supplier 1: N.A.; Supplier Part Number 1: N.A.; Supplier 2: N.A.; Supplier Part Number 2: N.A.; PartId: 100500464; Component Class: Connectors; Author: rsk; Part number Norautron: N.A.
U22 = 74LVC1G11GW: Single 3-input AND gate; Manufacturer: NXP Semiconductors; Part number IPS: 00000001430; Part number Norautron: N.A.; Artikkelnr Noca: 15079348; Pad Count: 6; Part Number: 74LVC1G11GW; Manufacturer Part Number: 74LVC1G11GW; Footprint Doc: SC70-6; LatestRevisionDate: 2016-10-18; Published: 2016-10-18; Value: 74LVC1G11; Note: Single 3-input AND gate; ComponentLink1URL: N.A.; ComponentLink1Description: Datasheet; ComponentLink2URL: N.A.; ComponentLink2Description: Supplier link; HelpURL: http://www.nxp.com/documents/data_sheet/74LVC1G11.pdf; Supplier 1: Digi-Key; Supplier Part Number 1: 568-7757-1-ND; Supplier 2: Farnell; Supplier Part Number 2: 243-8826; PartId: 101900157; Component Class: Misc_ICs; Author: rsk
U23 = 74LVC1G08GW: Single 2-Input AND Gate; Manufacturer: NXP Semiconductors; Part number IPS: 00000009992; Part number Norautron: N.A.; Artikkelnr Noca: 15049058; Pad Count: 5; Part Number: 74LVC1G08GW; Manufacturer Part Number: 74LVC1G08GW; Footprint Doc: SC70-5; LatestRevisionDate: 2016-10-18; Published: 2016-10-18; Value: 74LVC1G08; Note: Single 2-Input AND Gate; ComponentLink1URL: N.A.; ComponentLink1Description: Datasheet; ComponentLink2URL: N.A.; ComponentLink2Description: Supplier link; HelpURL: http://www.nxp.com/documents/data_sheet/74LVC1G08.pdf; Supplier 1: Digi-Key; Supplier Part Number 1: 568-1580-1-ND; Supplier 2: Farnell; Supplier Part Number 2: 242-8299; PartId: 101900155; Component Class: Misc_ICs; Author: rsk
U24-U26 U30-U33 = ADP198ACPZ: Logic Controlled, 1 A, High-Side Load Switch with Reverse Current Blocking; Manufacturer: Analog Devices; Part number IPS: 00000002999; Note: N.A.; Pad Count: 8; Part Number: ADP198ACPZ; Manufacturer Part Number: ADP198ACPZ; ComponentLink1URL: https://www.analog.com/media/en/technical-documentation/data-sheets/ADP198.pdf; ComponentLink1Description: Datasheet; ComponentLink2URL: N.A.; ComponentLink2Description: Supplier link; HelpURL: N.A.; Footprint Doc: UFDFN-8; LatestRevisionDate: 2019-03-01; Published: 2019-03-01; Value: ADP198ACPZ; Supplier 1: Digi-Key; Supplier Part Number 1: ADP198ACPZ-R7CT-ND; Supplier 2: N.A.; Supplier Part Number 2: N.A.; Artikkelnr Noca: N.A.; PartId: 101900577; Component Class: Misc_ICs; Author: rsk; Part number Norautron: N.A.
U27 = XC9236F08CER-G: 600mA Driver Transistor Built-In, Synchronous Step-Down DC/DC Converters; Manufacturer: Torex Semiconductor; Part number IPS: 00000009989; Note: N.A.; Pad Count: 6; Part Number: XC9236F08CER-G; Manufacturer Part Number: XC9236F08CER-G; Footprint Doc: USP-6C; LatestRevisionDate: 2017-11-15; Published: 2016-08-08; Value: XC9236; Artikkelnr Noca: N.A.; ComponentLink1URL: N.A.; ComponentLink1Description: Datasheet; ComponentLink2URL: N.A.; ComponentLink2Description: Supplier link; HelpURL: http://www.torexsemi.com/products/dcdc_converters/data/XC9235~37.pdf; Supplier 1: Mouser; Supplier Part Number 1: 865-XC9236F08CER-G; Supplier 2: N.A.; Supplier Part Number 2: N.A.; PartId: 101900206; Component Class: Misc_ICs; Author: rsk; Part number Norautron: N.A.
U28 = AP7333-33SAG-7: 300mA, Low Quiescent Current, Fast Transient Low Dropout Linear Regulator; Manufacturer: Diodes Incorporated; Part number IPS: 00000001673; Note: N.A.; Artikkelnr Noca: 17039216; Pad Count: 3; Part Number: AP7333-33SAG-7; Manufacturer Part Number: AP7333-33SAG-7; ComponentLink1URL: N.A.; ComponentLink1Description: Datasheet; ComponentLink2URL: N.A.; ComponentLink2Description: Supplier link; HelpURL: http://www.diodes.com/datasheets/AP7333.pdf; Footprint Doc: SOT-23-3; LatestRevisionDate: 2012-06-15; Published: 2012-06-15; Value: AP7333-33SAG-7; Supplier 1: Digi-Key; Supplier Part Number 1: AP7333-33SAG-7DICT-ND; Supplier 2: N.A.; Supplier Part Number 2: N.A.; PartId: 101900020; Component Class: Misc_ICs; Author: rsk; Part number Norautron: N.A.
U29 = TS27L2IPT: Precision very low power CMOS dual operational amplifier; Manufacturer: STMicroelectronics; Part number IPS: 00000009991; Note: N.A.; Artikkelnr Noca: 17010019; Pad Count: 8; Part Number: TS27L2IPT; Manufacturer Part Number: TS27L2IPT; Footprint Doc: TSSOP-8; LatestRevisionDate: 2016-07-07; Published: 2016-07-07; Value: TS27L2IPT; ComponentLink1URL: N.A.; ComponentLink1Description: Datasheet; ComponentLink2URL: N.A.; ComponentLink2Description: Supplier link; HelpURL: http://www.st.com/content/ccc/resource/technical/document/datasheet/38/5b/ca/bd/c0/26/4a/34/CD00000880.pdf/files/CD00000880.pdf/jcr:content/translations/en.CD00000880.pdf; Supplier 1: Digi-Key; Supplier Part Number 1: 497-8085-1-ND; Supplier 2: N.A.; Supplier Part Number 2: N.A.; PartId: 101900442; Component Class: Misc_ICs; Author: rsk; Part number Norautron: N.A.
Y1 = SHUNT JUMPER 2.54mm BLACK GOLD Horizontal (Obsolete): Shunt Jumper 2.54mm Black; Manufacturer: N.A.; Part number IPS: 00000001916; Note: SHUNT JUMPER .1" BLACK GOLD, h=6.00mm, w=5.00mm; Artikkelnr Noca: 56099001; Pad Count: 2; Part Number: SHUNT JUMPER 2.54mm BLACK GOLD Horizontal (Obsolete); Manufacturer Part Number: N.A.; ComponentLink1URL: N.A.; ComponentLink1Description: Datasheet; ComponentLink2URL: N.A.; ComponentLink2Description: Supplier link; HelpURL: N.A.; Footprint Doc: SHUNT JUMPER 2.54mm; LatestRevisionDate: 2021-06-28; Published: 2019-09-04; Value: Shunt 2.54mm; Supplier 1: Digi-Key; Supplier Part Number 1: S9001-ND, or similar; Supplier 2: N.A.; Supplier Part Number 2: N.A.; PartId: 100500644; Component Class: Connectors; Author: rsk; Part number Norautron: N.A.